# EAGLE design IOT FISH (EAGLE 9.6.2)
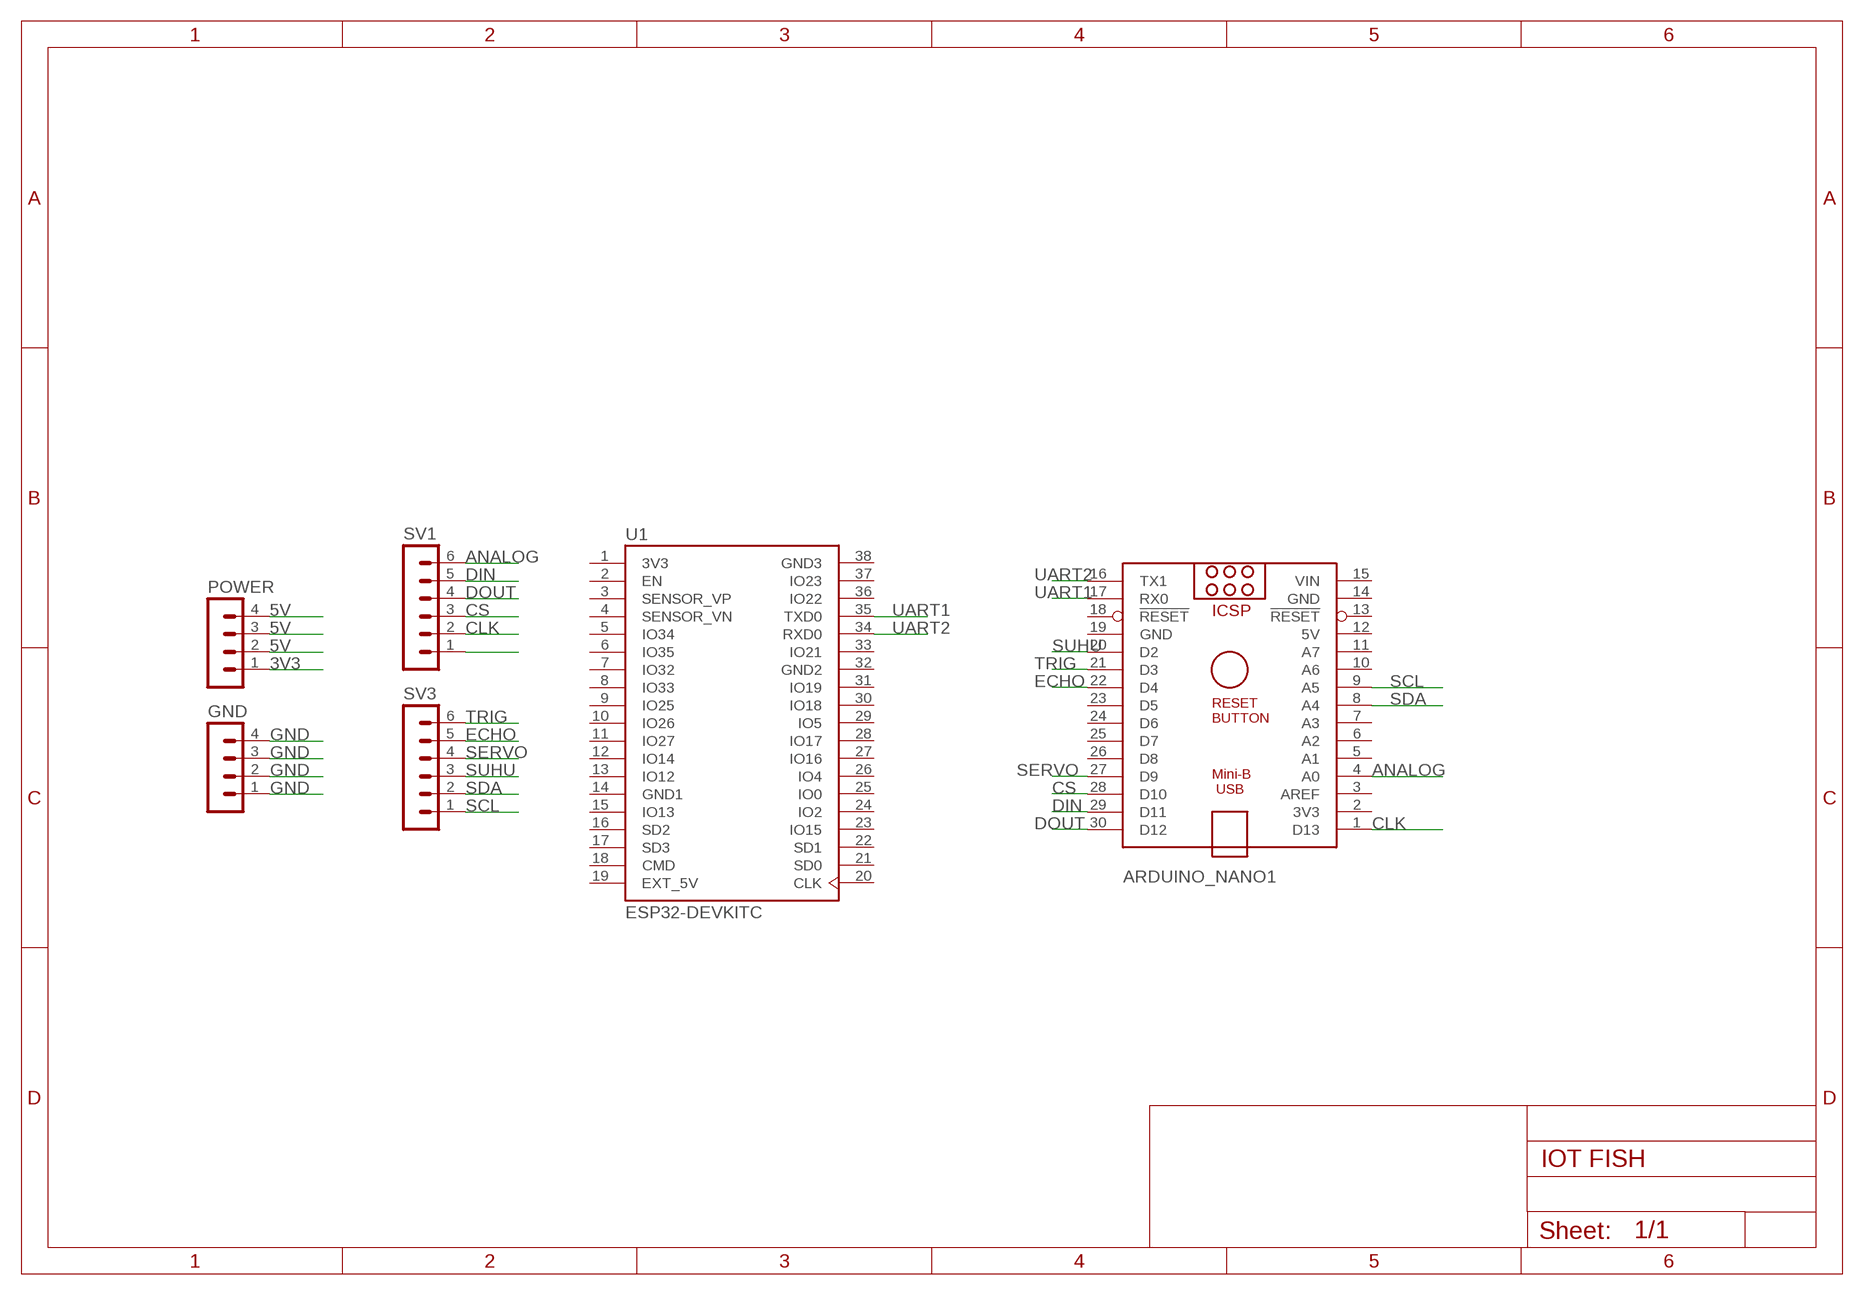
[diagram p0: schematic, sheet 1]

## Parts
ARDUINO_NANO1  ARDUINO_NANO  [ARDUINO_NANO]
GND  MA04-1  [MA04-1]
POWER  MA04-1  [MA04-1]
SV1  MA06-1  [MA06-1]
SV3  MA06-1  [MA06-1]
U1  ESP32-DEVKITC  [MODULE_ESP32-DEVKITC]

## Nets
3V3: POWER.1
5V: POWER.2 POWER.3 POWER.4
ANALOG: ARDUINO_NANO1.4(A0) SV1.6
CLK: ARDUINO_NANO1.1(D13) SV1.2
CS: ARDUINO_NANO1.28(D10) SV1.3
DIN: ARDUINO_NANO1.29(D11) SV1.5
DOUT: ARDUINO_NANO1.30(D12) SV1.4
ECHO: ARDUINO_NANO1.22(D4) SV3.5
GND: GND.1 GND.2 GND.3 GND.4
N$6: SV1.1
SCL: ARDUINO_NANO1.9(A5) SV3.1
SDA: ARDUINO_NANO1.8(A4) SV3.2
SERVO: ARDUINO_NANO1.27(D9) SV3.4
SUHU: ARDUINO_NANO1.20(D2) SV3.3
TRIG: ARDUINO_NANO1.21(D3) SV3.6
UART1: ARDUINO_NANO1.17(RX0) U1.35(TXD0)
UART2: ARDUINO_NANO1.16(TX1) U1.34(RXD0)
Unconnected: ARDUINO_NANO1.2(3V3) ARDUINO_NANO1.3(AREF) ARDUINO_NANO1.5(A1) ARDUINO_NANO1.6(A2) ARDUINO_NANO1.7(A3) ARDUINO_NANO1.10(A6) ARDUINO_NANO1.11(A7) ARDUINO_NANO1.13(!RESET) ARDUINO_NANO1.18(!RESET) ARDUINO_NANO1.23(D5) ARDUINO_NANO1.24(D6) ARDUINO_NANO1.25(D7) ARDUINO_NANO1.26(D8) U1.2(EN) U1.3(SENSOR_VP) U1.4(SENSOR_VN) U1.5(IO34) U1.6(IO35) U1.7(IO32) U1.8(IO33) U1.9(IO25) U1.10(IO26) U1.11(IO27) U1.12(IO14) U1.13(IO12) U1.15(IO13) U1.16(SD2) U1.17(SD3) U1.18(CMD) U1.20(CLK) U1.21(SD0) U1.22(SD1) U1.23(IO15) U1.24(IO2) U1.25(IO0) U1.26(IO4) U1.27(IO16) U1.28(IO17) U1.29(IO5) U1.30(IO18) U1.31(IO19) U1.33(IO21) U1.36(IO22) U1.37(IO23)

## Power pins joined to a net without a drawn wire
3V3: U1.1(3V3)
5V: ARDUINO_NANO1.12(5V)
EXT_5V: U1.19(EXT_5V)
GND: ARDUINO_NANO1.14(GND) ARDUINO_NANO1.19(GND)
GND1: U1.14(GND1)
GND2: U1.32(GND2)
GND3: U1.38(GND3)
VIN: ARDUINO_NANO1.15(VIN)

## Library data of the parts
ARDUINO_NANO1 = ArduinoNanoV30:ARDUINO_NANO: Arduino Nano V3.0 Overview: The Arduino Nano is a small, complete, and breadboard-friendly board based on the ATmega328 (Arduino Nano 3.x) or ATmega168 (Arduino Nano 2.x). It has more or less the same functionality of the Arduino Duemilanove, but in a different package. It lacks only a DC power jack, and works with a Mini-B USB cable instead of a standard one. The Nano was designed and is being produced by Gravitech. Specifications: Microcontroller Atmel ATmega168 or ATmega328 Operating Voltage (logic level) 5 V Input Voltage (recommended) 7-12 V Input Voltage (limits) 6-20 V Digital I/O Pins 14 (of which 6 provide PWM output) Analog Input Pins 8 DC Current per I/O Pin 40 mA Flash Memory 16 KB (ATmega168) or 32 KB (ATmega328) of which 2 KB used by bootloader SRAM 1 KB (ATmega168) or 2 KB (ATmega328) EEPROM 512 bytes (ATmega168) or 1 KB (ATmega328) Clock Speed 16 MHz Dimensions 0.73" x 1.70" Length 45 mm Width 18 mm Weigth 5 g Power: The Arduino Nano can be powered via the Mini-B USB connection, 6-20V unregulated external power supply (pin 30), or 5V regulated external power supply (pin 27). The power source is automatically selected to the highest voltage source. Memory: The ATmega168 has 16 KB of flash memory for storing code (of which 2 KB is used for the bootloader); the ATmega328 has 32 KB, (also with 2 KB used for the bootloader). The ATmega168 has 1 KB of SRAM and 512 bytes of EEPROM (which can be read and written with the EEPROM library); the ATmega328 has 2 KB of SRAM and 1 KB of EEPROM. Input and Output: Each of the 14 digital pins on the Nano can be used as an input or output, using pinMode(), digitalWrite(), and digitalRead() functions. They operate at 5 volts. Each pin can provide or receive a maximum of 40 mA and has an internal pull-up resistor (disconnected by default) of 20-50 kOhms. In addition, some pins have specialized functions. Visit Arduino - ArduinoBoardNano <https://www.arduino.cc/en/Main/ArduinoBoardNano>
GND POWER = con-lstb:MA04-1: PIN HEADER; OC_FARNELL: unknown; OC_NEWARK: unknown
SV1 SV3 = con-lstb:MA06-1: PIN HEADER; OC_FARNELL: unknown; OC_NEWARK: unknown
U1 = ESP32-DEVKITC:ESP32-DEVKITC: ESP32-DEVKITC Check availability <https://pricing.snapeda.com/parts/ESP32-DEVKITC/Olimex%20LTD/view-part?ref=eda>; AVAILABILITY: In Stock; CHECK_PRICES: https://www.snapeda.com/parts/ESP32-DEVKITC/Olimex+LTD/view-part/?ref=eda; DESCRIPTION: ESP32-WROOM32 - Transceiver; 802.11 b/g/n (Wi-Fi, WiFi, WLAN), Bluetooth® Smart 4.x Low Energy (BLE) 2.4GHz Evaluation Board; MF: Olimex LTD; MP: ESP32-DEVKITC; PACKAGE: None; PRICE: None; SNAPEDA_LINK: https://www.snapeda.com/parts/ESP32-DEVKITC/Olimex+LTD/view-part/?ref=snap

## Board
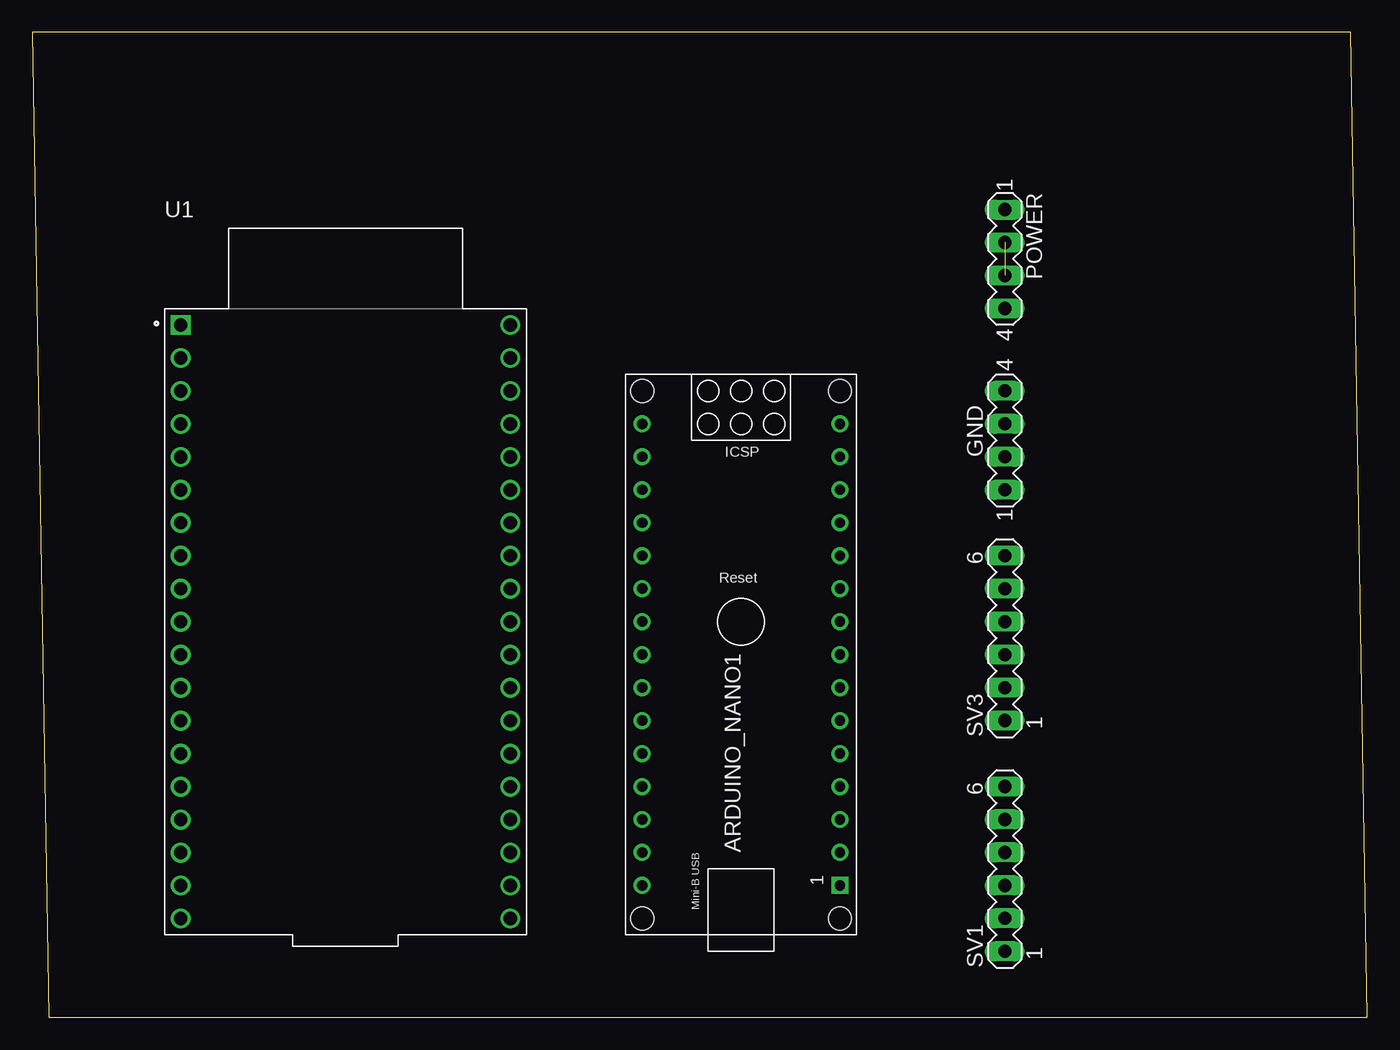
[diagram p1: board, top side]
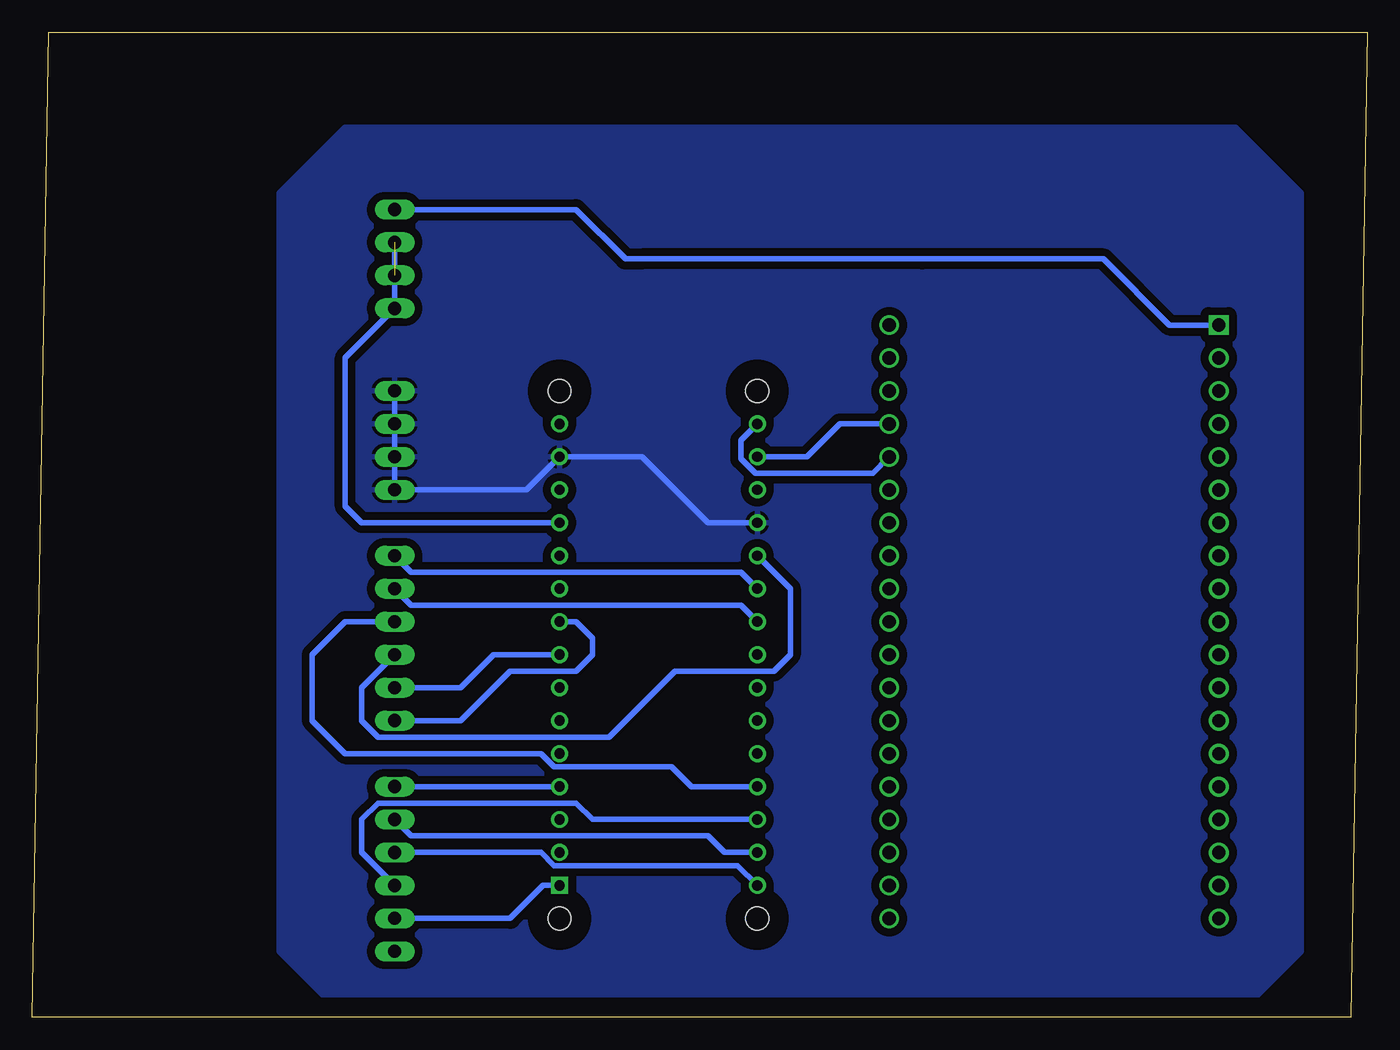
[diagram p2: board, bottom side, seen from below]

Size 102.85 x 75.87 mm. Coordinates in mm from the lower left corner, seen from the top.
Outline: 1.27,0 102.85,0 101.58,75.87 0,75.87 1.27,0
Copper layers (1*16): Top 0.035mm / dielectric 1.5mm / Bottom 0.035mm
Design rules "default *": minimum track width 6mil, minimum drill 0.35mm, track to track 6mil, track to pad 6mil, pad to pad 6mil, via to via 6mil, smd to smd 6mil, copper to edge 60mil, drill to drill 6mil, minimum pad ring 10mil, minimum via ring 8mil, stop-mask expansion 4mil, vias tented up to drill 0mil, thermal gap 10mil

### Footprints (pad centres in the part's own frame; a part is rotated, then mirrored left to right if it is on the bottom)
ARDUINO_NANO = drill 0.8 square: 1 -20.32,-7.62 | drill 0.8: 2 -17.78,-7.62; 3 -15.24,-7.62; 4 -12.7,-7.62; 5 -10.16,-7.62; 6 -7.62,-7.62; 7 -5.08,-7.62; 8 -2.54,-7.62; 9 0,-7.62; 10 2.54,-7.62; 11 5.08,-7.62; 12 7.62,-7.62; 13 10.16,-7.62; 14 12.7,-7.62; 15 15.24,-7.62; 16 15.24,7.62; 17 12.7,7.62; 18 10.16,7.62; 19 7.62,7.62; 20 5.08,7.62; 21 2.54,7.62; 22 0,7.62; 23 -2.54,7.62; 24 -5.08,7.62; 25 -7.62,7.62; 26 -10.16,7.62; 27 -12.7,7.62; 28 -15.24,7.62; 29 -17.78,7.62; 30 -20.32,7.62 | hole 1.778: -22.86,-7.62; -22.86,7.62; 17.78,7.62; 17.78,-7.62
MA04-1 = drill 1.016 long: 1 -3.81,0; 2 -1.27,0; 3 1.27,0; 4 3.81,0
MA06-1 = drill 1.016 long: 1 -6.35,0; 2 -3.81,0; 3 -1.27,0; 4 1.27,0; 5 3.81,0; 6 6.35,0
MODULE_ESP32-DEVKITC = drill 1.02 square: 1 -12.7,22.85 | drill 1.02: 2 -12.7,20.31; 3 -12.7,17.77; 4 -12.7,15.23; 5 -12.7,12.69; 6 -12.7,10.15; 7 -12.7,7.61; 8 -12.7,5.07; 9 -12.7,2.53; 10 -12.7,-0.01; 11 -12.7,-2.55; 12 -12.7,-5.09; 13 -12.7,-7.63; 14 -12.7,-10.17; 15 -12.7,-12.71; 16 -12.7,-15.25; 17 -12.7,-17.79; 18 -12.7,-20.33; 19 -12.7,-22.87; 20 12.7,-22.87; 21 12.7,-20.33; 22 12.7,-17.79; 23 12.7,-15.25; 24 12.7,-12.71; 25 12.7,-10.17; 26 12.7,-7.63; 27 12.7,-5.09; 28 12.7,-2.55; 29 12.7,-0.01; 30 12.7,2.53; 31 12.7,5.07; 32 12.7,7.61; 33 12.7,10.15; 34 12.7,12.69; 35 12.7,15.23; 36 12.7,17.77; 37 12.7,20.31; 38 12.7,22.85

### Placement (x,y rotation side)
ARDUINO_NANO1  54.61,30.48 90 top
GND  74.93,44.45 90 top
POWER  74.93,58.42 270 top
SV1  74.93,11.43 90 top
SV3  74.93,29.21 90 top
U1  24.13,30.48 0 top

### Tracks (layer width: path | path; a pad name or v marks a point on that pad's centre or on a via)
3V3
  Bottom 0.406: POWER.1 60.96,62.23 57.15,58.42 55.88,58.42 | 55.88,58.42 34.29,58.42 20.32,58.42 15.23,53.33 U1.1 | 55.88,58.42
5V  (1 unrouted)
  Bottom 0.406: ARDUINO_NANO1.12 77.47,38.1 78.74,39.37 78.74,50.8 POWER.4 POWER.2
ANALOG
  Bottom 0.406: ARDUINO_NANO1.4 SV1.6
CLK
  Bottom 0.406: ARDUINO_NANO1.1 63.5,10.16 66.04,7.62 SV1.2
CS
  Bottom 0.406: ARDUINO_NANO1.28 59.69,15.24 60.96,16.51 76.2,16.51 77.47,15.24 77.47,12.7 SV1.3
DIN
  Bottom 0.406: SV1.5 73.66,13.97 50.8,13.97 49.53,12.7 ARDUINO_NANO1.29
DOUT
  Bottom 0.406: SV1.4 63.66,12.7 62.65,11.69 48.52,11.69 ARDUINO_NANO1.30
ECHO
  Bottom 0.406: ARDUINO_NANO1.22 48.26,31.75 73.66,31.75 SV3.5
GND
  Bottom 0.406: ARDUINO_NANO1.19 50.8,38.1 55.88,43.18 ARDUINO_NANO1.14 64.77,40.64 GND.1 GND.4
  pour Bottom (isolate 0.61): 7.62,66.04 10.16,68.58 78.74,68.58 81.28,66.04 83.82,63.5 83.82,8.89 83.82,5.08 81.28,2.54 80.01,1.27 8.89,1.27 5.08,5.08 5.08,8.89 5.08,63.5
SCL
  Bottom 0.406: SV3.1 69.85,22.86 66.04,26.67 60.96,26.67 59.69,27.94 59.69,29.21 60.96,30.48 ARDUINO_NANO1.9
SDA
  Bottom 0.406: SV3.2 69.85,25.4 67.31,27.94 ARDUINO_NANO1.8
SERVO
  Bottom 0.406: SV3.4 78.74,30.48 81.28,27.94 81.28,22.86 78.74,20.32 63.66,20.32 62.65,19.31 53.6,19.31 52.07,17.78 ARDUINO_NANO1.27
SUHU
  Bottom 0.406: ARDUINO_NANO1.20 44.45,33.02 44.45,27.94 45.72,26.67 53.34,26.67 58.42,21.59 76.2,21.59 77.47,22.86 77.47,25.4 SV3.3
TRIG
  Bottom 0.406: SV3.6 73.66,34.29 48.26,34.29 ARDUINO_NANO1.21
UART1
  Bottom 0.406: ARDUINO_NANO1.17 43.18,43.18 40.64,45.72 U1.35
UART2
  Bottom 0.406: U1.34 38.09,41.91 47.15,41.91 48.26,43.02 48.26,44.45 ARDUINO_NANO1.16